# Altium schematic sheet ESP32-Cam.SchDoc: ESP32-CAM
size 292 x 203 mm; DrawnBy: DMGB Nawarathna; DocumentNumber: -; SheetNumber: 2; SheetTotal: 4; Project: Product Sorter; DateDrawn: 4/4/2024
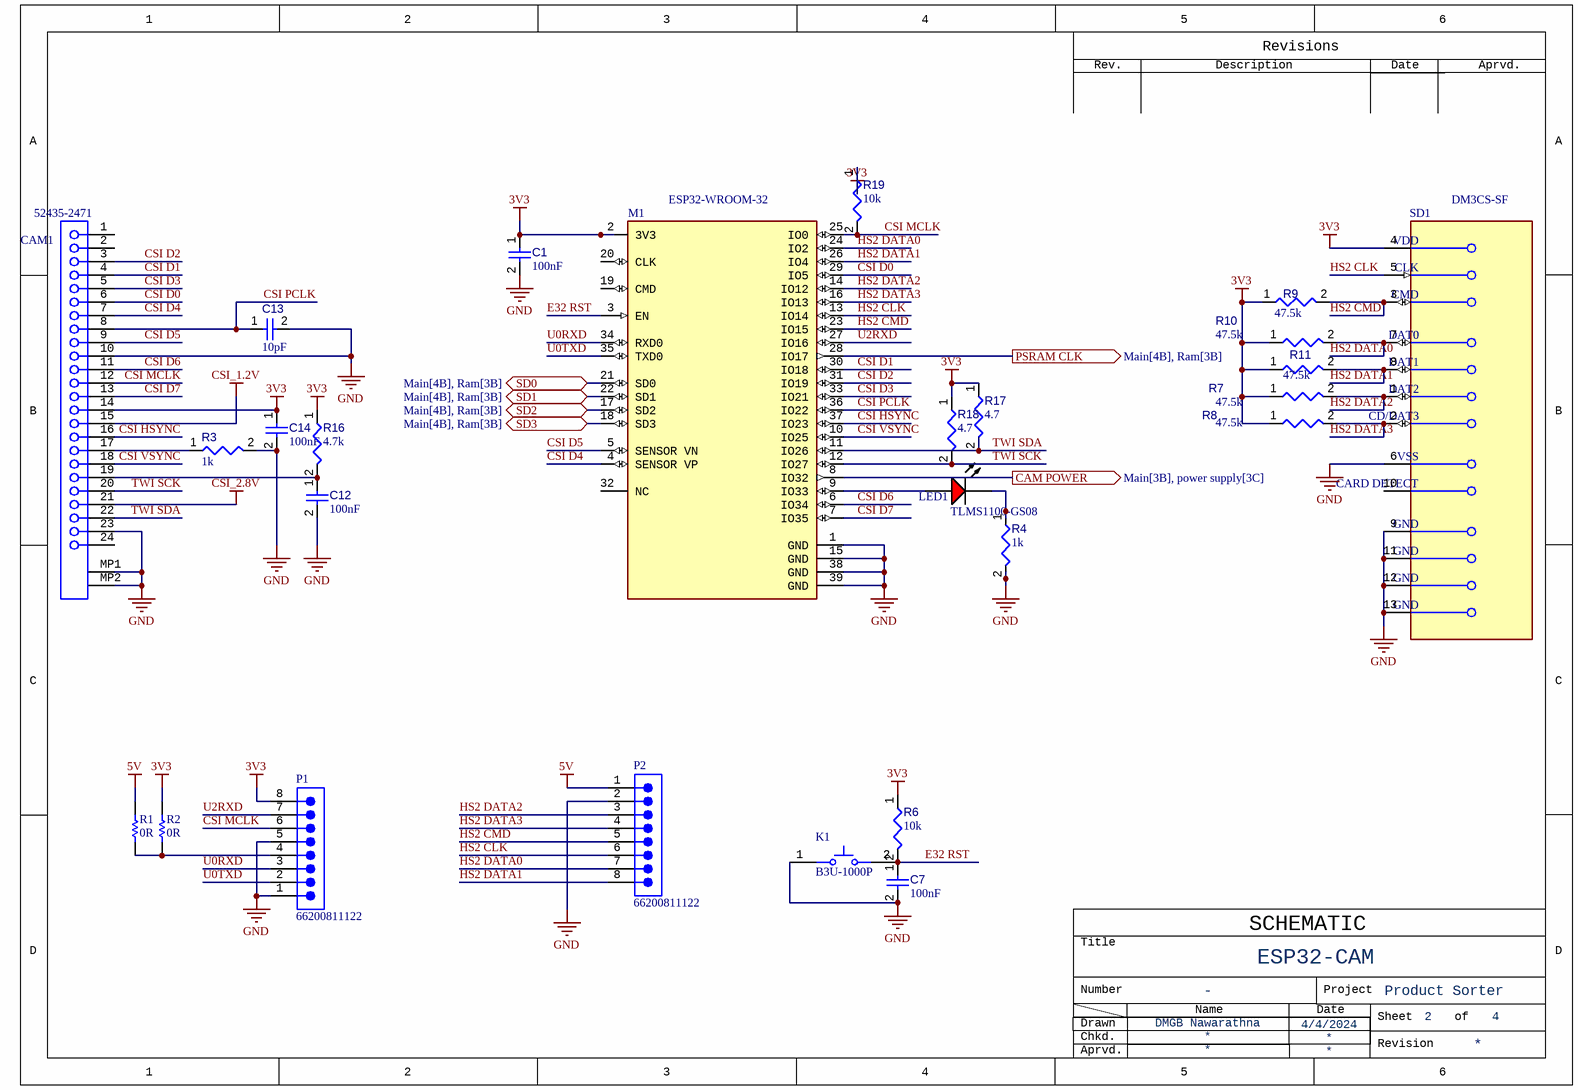
[diagram p0: ESP32-Cam.SchDoc]

## Parts
C1  value 100nF  [CAPC1005X56X25LL10T15]  (hidden comment: Capacitor 0.1 uF +/- 5% 16 V 0402)
C7  value 100nF  [CAPC1005X56X25LL10T15]  (hidden comment: Capacitor 0.1 uF +/- 5% 16 V 0402)
C12  value 100nF  [CAPC1005X56X25LL10T15]  (hidden comment: Capacitor 0.1 uF +/- 5% 16 V 0402)
C13  value 10pF  [CAPC1005X55X25ML05T05]  (hidden comment: Capacitor 10 pF +/- 5% 50 V 0402)
C14  value 100nF  [CAPC1005X56X25LL10T15]  (hidden comment: Capacitor 0.1 uF +/- 5% 16 V 0402)
CAM1  52435-2471  [MOLX-52435-2471]
K1  B3U-1000P  [OMRON-B3U-1000_V]
LED1  TLMS1100-GS08  [VISH-TLMX1100_V]
M1  ESP32-WROOM-32  [FP-ESP32-WROOM-32-MFG]
P1  66200811122  [66200811122]
P2  66200811122  [66200811122]
R1  value 0R  [RESC1005X40X25ML05T10]  (hidden comment: Resistor 0R 0402 63 mW)
R2  value 0R  [RESC1005X40X25ML05T10]  (hidden comment: Resistor 0R 0402 63 mW)
R3  value 1k  [RESC0805(2012)_L]  (hidden comment: Resistor 1K +/-5% 0805 125 mW)
R4  value 1k  [RESC0805(2012)_L]  (hidden comment: Resistor 1K +/-5% 0805 125 mW)
R6  value 10k  [RESC0402(1005)_L]  (hidden comment: Resistor 10K  +/-1 % 0402 63 mW)
R7  value 47.5k  [RESC0402(1005)_L]  (hidden comment: Resistor 47K5 +/-1 % 0402 63 mW)
R8  value 47.5k  [RESC0402(1005)_L]  (hidden comment: Resistor 47K5 +/-1 % 0402 63 mW)
R9  value 47.5k  [RESC0402(1005)_L]  (hidden comment: Resistor 47K5 +/-1 % 0402 63 mW)
R10  value 47.5k  [RESC0402(1005)_L]  (hidden comment: Resistor 47K5 +/-1 % 0402 63 mW)
R11  value 47.5k  [RESC0402(1005)_L]  (hidden comment: Resistor 47K5 +/-1 % 0402 63 mW)
R16  value 4.7k  [RESC1005X40X25ML05T05]  (hidden comment: Resistor 4k7 +/-1% 0402 100 mW)
R17  value 4.7  [RESC0805(2012)_L]  (hidden comment: Resistor 4R7  +/-5 % 0805 125 mW)
R18  value 4.7  [RESC0805(2012)_L]  (hidden comment: Resistor 4R7  +/-5 % 0805 125 mW)
R19  value 10k  [RESC2013X50X35ML15T15]  (hidden comment: Resistor 10k +/-1% 0805 125 mW)
SD1  DM3CS-SF  [FP-DM3CS-SF-MFG]

## Ports
CAM POWER (out, see Main[3B], power supply[3C]), PSRAM CLK (out, see Main[4B], Ram[3B]), SD0 (bidir, see Main[4B], Ram[3B]), SD1 (bidir, see Main[4B], Ram[3B]), SD2 (bidir, see Main[4B], Ram[3B]), SD3 (bidir, see Main[4B], Ram[3B])

## Nets
3V3: C1.1 C14.1 CAM1.14 M1.2(3V3) P1.8 R2.1 R6.1 R7.1 R8.1 R9.1 R10.1 R11.1 R16.1 R17.1 R18.1 R19.1 SD1.4(VDD)
5V: P2.1 R1.1
CSI_1.2V: CAM1.15
CSI_2.8V: CAM1.21
GND: C1.2 C7.2 C12.2 C13.2 C14.2 CAM1.10 CAM1.23 CAM1.MP1 CAM1.MP2 K1.1 M1.1(GND) M1.15(GND) M1.38(GND) M1.39(GND) P1.1 P1.5 P2.2 R3.2 R4.2 SD1.6(VSS) SD1.9(GND) SD1.11(GND) SD1.12(GND) SD1.13(GND)
CAM POWER: M1.8(IO32) ; port CAM POWER
CSI D0: CAM1.6 M1.29(IO5)
CSI D1: CAM1.4 M1.30(IO18)
CSI D2: CAM1.3 M1.31(IO19)
CSI D3: CAM1.5 M1.33(IO21)
CSI D4: CAM1.7 M1.4(SENSOR_VP)
CSI D5: CAM1.9 M1.5(SENSOR_VN)
CSI D6: CAM1.11 M1.6(IO34)
CSI D7: CAM1.13 M1.7(IO35)
CSI HSYNC: CAM1.16 M1.37(IO23)
CSI MCLK: CAM1.12 M1.25(IO0) P1.6 R19.2
CSI PCLK: C13.1 CAM1.8 M1.36(IO22)
CSI VSYNC: CAM1.18 M1.10(IO25)
E32 RST: C7.1 K1.2 M1.3(EN) R6.2
HS2 CLK: M1.13(IO14) P2.6 SD1.5(CLK)
HS2 CMD: M1.23(IO15) P2.5 R9.2 SD1.3(CMD)
HS2 DATA0: M1.24(IO2) P2.7 R10.2 SD1.7(DAT0)
HS2 DATA1: M1.26(IO4) P2.8 R11.2 SD1.8(DAT1)
HS2 DATA2: M1.14(IO12) P2.3 R7.2 SD1.1(DAT2)
HS2 DATA3: M1.16(IO13) P2.4 R8.2 SD1.2(CD/DAT3)
PSRAM CLK: M1.28(IO17) ; port PSRAM CLK
SD0: M1.21(SD0) ; port SD0
SD1: M1.22(SD1) ; port SD1
SD2: M1.17(SD2) ; port SD2
SD3: M1.18(SD3) ; port SD3
TWI SCK: CAM1.20 M1.12(IO27) R18.2
TWI SDA: CAM1.22 M1.11(IO26) R17.2
U0RXD: M1.34(RXD0) P1.3
U0TXD: M1.35(TXD0) P1.2
U2RXD: M1.27(IO16) P1.7
NetC12_1: C12.1 CAM1.19 R16.2
NetCAM1_17: CAM1.17 R3.1
NetLED1_1: LED1.1(A) M1.9(IO33)
NetLED1_2: LED1.2(K) R4.1
NetP1_4: P1.4 R1.2 R2.2

Not connected (* = marked no-connect by the designer): CAM1 1 2 24; M1 19(CMD) 20(CLK) 32(NC); SD1 10(CARD_DETECT)

## Notes on the sheet
- Rev.
- Description
- Revisions
- Date
- Aprvd.
- Title
- SCHEMATIC
- Number
- Drawn
- Chkd.
- Name
- Project
- Sheet      of
- Revision

## Library data of the parts
C1 C7 C12 C14 = CMP-001-00001-6: Chip Capacitor, 0.1 uF, +/- 5%, 16 V, 0402 (1005 Metric); Capacitor Type: Ceramic; Voltage Rating: 16V; Max Operating Temperature: 125°C; Min Operating Temperature: -55°C; Case/Package: 0402; Mounting Technology: SM; Pins: 2; Tolerance: 5%; RoHS Compliant: True
C13 = CMP-001-00013-6: Chip Capacitor, 10 pF, +/- 5%, 50 V, 0402 (1005 Metric); Capacitor Type: Ceramic; Voltage Rating: 50V; Max Operating Temperature: 125°C; Pins: 2; Mounting Technology: SM; Tolerance: 5%; RoHS Compliant: True; Case/Package: 0402; Min Operating Temperature: -55°C
CAM1 = CMP-1241-00275-1: 0.5 mm Pitch Easy-On(TM) Type FPC Connector, 2.0 mm Mated Height, Right Angle, ZIF, SMT, Top Contact, 24 Circuits, -40 to 85 degC, ELV and RoHS Compliant, Tape and Reel; Manufacturer: Molex; Pitch - Mating Interface: 0.50mm; PCB Locator: No; Current (Max per Contact): 0.5A; PCB Retention: Yes; Circuits (Loaded): 24; Material - Metal: Phosphor Bronze; Material - Plating Termination: Gold; Mated Height: 2.00mm; Entry Angle: 90degrees Angle; Durability (mating cycles max): 20; Voltage (Max): 50V AC (RMS)/DC; PartNumber: 52435-2471; ComponentLink1Description: Manufacturer URL; Polarized to PCB: Yes; Contact Position: Top; RoHS: TRUE; ComponentLink3Description: Package Specification; Mounting Technology: Surface Mount; ComponentLink2URL: http://www.molex.com/webdocs/datasheets/pdf/en-us/0524352471_FFC_FPC_CONNECTORS.pdf; PackageDescription: 24-Lead FPC Connector, Pitch 0.5 mm; Packing: Tape and Reel; ComponentLink1URL: http://www.molex.com/molex/index.jsp; PackageVersion: Rev. D, 07/2010; ComponentLink3URL: http://www.molex.com/pdm_docs/sd/524352471_sd.pdf; Stackable: No; PackageReference: 52435-2471; Number of Rows: 1; ComponentLink2Description: Datasheet; Orientation: Right Angle; Material - Plating Mating: Gold
K1 = CMP-011-00000-2: Tactile Switch, SPST-NO, 0.05 A, 12 V, -25 to 70 degC, 2-Pin SMD, RoHS, Tape and Reel; Manufacturer: Omron Electronic Components; IP Rating: IP40; Current Rating: 50mA; Max Contact Resistance: 100mohm; Operating Force: 153gf; Throw Configuration: SPST; Resistance: 0.1Ohm; Max Voltage Rating (DC): 12V; Contact Material: Silver; Max Current Rating: 50mA; Datasheet URL: http://www.omron.com/ecb/products/pdf/en-b3u.pdf; Mounting Technology: SM; Case/Package: B3U-1000; Packaging: TapeandReel; Package Reference: B3U-1000; Manufacturer URL: http://www.omron.com/; Datasheet Version: Jan-15; RoHS Compliant: True; Max Operating Temperature: 70°C; Contact Current Rating: 50mA; Package Quantity: 3500; Package Description: 2-Pin Surface Mount Device, Body 3 x 2.5 mm; Voltage Rating (DC): 12V; Min Operating Temperature: -25°C; Voltage Rating: 12V
LED1 = CMP-007-00030-2: Red Led, 20mA, 2.1 V, -40 to 100 degC, 2-Pin SMD (0603), RoHS, Tape and Reel; Manufacturer: Vishay Semiconductor; Viewing Angle: 160degrees; Forward Voltage: 2.1V; Lens Style: Clear; Power: 90mW; Luminous Intensity: 63mcd; Datasheet Version: Rev. 2.7, 03/2016; Package Quantity: 3000; Colour: Red; Package Description: 2-Pin Surface Mount Device, Body 1.6 x 0.8 mm; Datasheet URL: http://www.vishay.com/docs/83173/tlmb1100.pdf; Package Reference: TLMX1100; Max Operating Temperature: 100°C; Mounting Technology: SM; Packaging: TapeandReel; Case/Package: 0603; Illumination Colour: Red; Forward Current: 20mA; Manufacturer URL: http://www.vishay.com/; RoHS Compliant: True; Min Operating Temperature: -40°C; Nominal Vf: 2.1V; Pins: 2
M1 = CMP-194065-000008-1: RX TXRX MOD WIFI SURFACE MOUNT; Frequency: 2.5GHz; Sensitivity: -98dBm; Operating Supply Voltage: 3.6V; Data Rate: 150Mbps; Weight: 0.088185oz; Package Quantity: 550; Min Operating Temperature: -40°C; Mount: Surface Mount; Max Operating Temperature: 85°C; Packaging: Cut Tape; Case/Package: SMD/SMT
P1 P2 = CMP-1502-00446-2: NexarPartId: 23024701; Pitch: 3mm; Number of Contacts: 8; Insulation Resistance: 1GΩ; Connector Type: Male Pin, Socket; Contact Resistance: 10mΩ; Gender: Male; Current Rating: 5A; Operating Supply Voltage: 250V; Height: 11mm; Max Operating Temperature: 105°C; Mount: Through Hole; Orientation: Vertical; Fastening Type: Ramp; Number of Positions: 8; Lead Pitch: 3mm; Number of Rows: 1; RoHS: Compliant; Termination: Kinked Pin; Width: 27.65mm; Contact Material: Copper; REACH SVHC: Unknown; Contact Plating: Tin; Length: 27.65mm; Color: Black; Min Operating Temperature: -40°C; Number of Pins: 8
R1 R2 = CMP-009-00004-5: Chip Resistor, 0 Ohm, 0.063 W, -55 to 155 degC, 0402 (1005 Metric); Power: 63mW; Voltage Rating: 50V; Max Operating Temperature: 155°C; Pins: 2; RoHS Compliant: True; Min Operating Temperature: -55°C; Mounting Technology: SM; Case/Package: 0402
R3 R4 = CMP-009-00118-3: Chip Resistor, 1 kOhms, +/-5%, 125 mW, -55 to 155 degC, 0805; Tolerance: 5%; Power: 125mW; Case/Package: 0805; Pins: 2; Min Operating Temperature: -55°C; Max Operating Temperature: 155°C
R6 = CMP-009-00149-3: Chip Resistor, 10 kOhms, +/-1 %, 63 mW, -55 to 125 degC, 0402; Power: 63mW; Tolerance: 1%; Min Operating Temperature: -55°C; Case/Package: 0402; Max Operating Temperature: 155°C; Pins: 2
R7-R11 = CMP-009-00137-3: Chip Resistor, 47,5 kOhms, +/-1 %, 63 mW, -55 to 155 degC, 0402; Power: 63mW; Tolerance: 1%; Pins: 2; Case/Package: 0402; Min Operating Temperature: -55°C; Max Operating Temperature: 155°C
R16 = CMP-009-00030-5: Chip Resistor, 4.7 KOhm, +/- 1%, 0.1 W, -55 to 155 degC, 0402 (1005 Metric); Power: 100mW; Voltage Rating: 50V; Mounting Technology: SM; RoHS Compliant: True; Tolerance: 1%; Min Operating Temperature: -55°C; Max Operating Temperature: 155°C; Case/Package: 0402; Pins: 2
R17 R18 = CMP-009-00174-3: Chip Resistor, 4,7 Ohms, +/-5 %, 125 mW, -55 to 155 degC, 0805; Tolerance: 5%; Power: 125mW; Max Operating Temperature: 155°C; Case/Package: 0805; Min Operating Temperature: -55°C; Pins: 2
R19 = CMP-009-00018-5: Chip Resistor, 10 KOhm, +/- 1%, 125 mW, -55 to 155 degC, 0805 (2012 Metric); Power: 125mW; Voltage Rating: 150V; Tolerance: 1%; Pins: 2; Min Operating Temperature: -55°C; Case/Package: 0805; Max Operating Temperature: 155°C; RoHS Compliant: True; Mounting Technology: SM
SD1 = CMP-11597-000003-1: CONN MICRO SD CARD HINGED TYPE; Pitch: 1.1mm; Connector Type: Connector; Current Rating: 500mA; Voltage Rating (AC): 125V; Gender: Female; Insulation Resistance: 1GR; Number of Positions: 8; Contact Resistance: 100mR; Packaging: Tape and Reel; Flammability Rating: UL94 V-0; Lead Free: Lead Free; Min Operating Temperature: -25°C; Orientation: Right Angle; Width: 13.8mm; Number of Rows: 1; Housing Material: Polymer; Package Quantity: 1; Mount: Surface Mount; Max Current Rating: 500mA; Radiation Hardening: No; Max Operating Temperature: 85°C; Contact Plating: Gold; Depth: 1.83mm; Contact Material: Gold; Length: 14.1mm; Number of Contacts: 8; Termination: Solder